# EAGLE schematic Main (EAGLE 9.3.2)
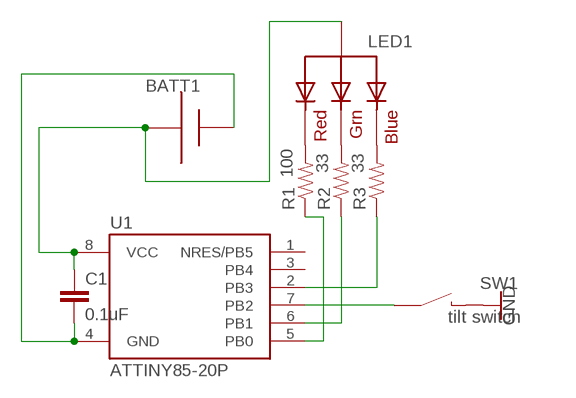
[diagram p0: schematic, sheet 1]

## Parts
BATT1  AAA  [12BH412]
C1  0.1uF  0.1UF-0603-25V-(+80/-20%)  [0603]
LED1  RGBLED_CA-5MM  [LED5MMRGB]
R1  100  33OHM-0603-1/10W-1%  [0603]
R2  33  33OHM-0603-1/10W-1%  [0603]
R3  33  33OHM-0603-1/10W-1%  [0603]
SW1  46202LRX  [46202LRX]
U1  ATTINY85-20P  [PDIP08_300MIL]

## Nets
GND: SW1.P$2(B)
N$1: BATT1.- C1.1 LED1.2(VCC) U1.8(VCC)
N$2: BATT1.+ C1.2 U1.4(GND)
N$3: SW1.P$1(A1) U1.7(PB2)
N$4: LED1.1(RED) R1.2
N$5: LED1.3(GREEN) R2.2
N$6: LED1.4(BLUE) R3.2
N$7: R1.1 U1.5(PB0)
N$8: R2.1 U1.6(PB1)
N$9: R3.1 U1.2(PB3)
Unconnected: U1.1(NRES/PB5) U1.3(PB4)

## Library data of the parts
BATT1 = adafruit:AAA: AAA PC pin holder Mouser part #12BH412 - but pretty much any 1x AAA battery holder should be the same http://www.ladyada.net/library/pcb/eaglelibrary.html
C1 = SparkFun-Capacitors:0.1UF: 0.1µF ceramic capacitors A capacitor is a passive two-terminal electrical component used to store electrical energy temporarily in an electric field.; PROD_ID: CAP-00810
LED1 = adafruit:RGBLED_CA: RGB LED, common-anode 5MM Staggered pins 5mm Piranha package http://www.ladyada.net/library/pcb/eaglelibrary.html
R1 = SparkFun-Resistors:33OHM: 33Ω resistor A resistor is a passive two-terminal electrical component that implements electrical resistance as a circuit element. Resistors act to reduce current flow, and, at the same time, act to lower voltage levels within circuits. - Wikipedia; PROD_ID: RES-08270; VALUE: 33
R2 R3 = SparkFun-Resistors:33OHM: 33Ω resistor A resistor is a passive two-terminal electrical component that implements electrical resistance as a circuit element. Resistors act to reduce current flow, and, at the same time, act to lower voltage levels within circuits. - Wikipedia; PROD_ID: RES-08270
SW1 = DC_LOAD_AU:46202LRX: 46202LRX Switch; TYPE: tilt switch
U1 = _hhn_attiny25_45_85:ATTINY85*: ATMEL ATtiny 85 Packages: P = PDIP 08 30mil S = SOIC 08 EIAJ 208mil Technologies Note: for complete ordering code (temp. range, finish, tape&reel etc.) see www.atmel.com • Supply Voltage: V = (1.8…5.5)V | [blank] = (2.7…5.5)V • Speed: 10 = 10 MHz | 20 = 20 MHz Author: Dipl.-Ing. FH Rainer Bayer HHN Hochschule Heilbronn (Heilbronn University), rainer.bayer@hs-heilbronn.de Ingenieurbüro ing-rb, mail@ing-rb.de